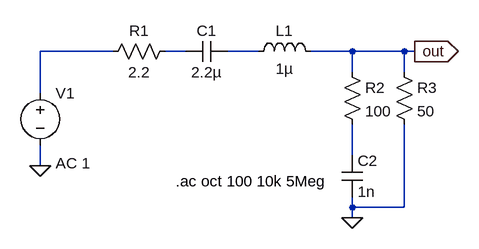
[diagram p0: schematic TI_TX.asc]
TI_TX.asc, the LTspice schematic file:
Version 4
SHEET 1 880 680
WIRE -160 96 -272 96
WIRE -48 96 -80 96
WIRE 64 96 16 96
WIRE 208 96 144 96
WIRE 288 96 208 96
WIRE 304 96 288 96
WIRE 208 128 208 96
WIRE 288 128 288 96
WIRE -272 160 -272 96
WIRE 208 256 208 208
WIRE -272 272 -272 240
WIRE 208 336 208 320
WIRE 288 336 288 208
WIRE 288 336 208 336
WIRE 208 352 208 336
FLAG -272 272 0
FLAG 304 96 out
IOPIN 304 96 Out
FLAG 208 352 0
SYMBOL res -64 80 R90
WINDOW 0 0 56 VBottom 2
WINDOW 3 32 56 VTop 2
SYMATTR InstName R1
SYMATTR Value 2.2
SYMBOL cap 16 80 R90
WINDOW 0 0 32 VBottom 2
WINDOW 3 32 32 VTop 2
SYMATTR InstName C1
SYMATTR Value 2.2µ
SYMBOL ind 48 112 R270
WINDOW 0 32 56 VTop 2
WINDOW 3 5 56 VBottom 2
SYMATTR InstName L1
SYMATTR Value 1µ
SYMBOL voltage -272 144 R0
WINDOW 3 24 152 Left 2
WINDOW 123 24 124 Left 2
WINDOW 39 0 0 Left 2
SYMATTR Value ""
SYMATTR Value2 AC 1
SYMATTR InstName V1
SYMBOL res 192 112 R0
SYMATTR InstName R2
SYMATTR Value 100
SYMBOL cap 192 256 R0
SYMATTR InstName C2
SYMATTR Value 1n
SYMBOL res 272 112 R0
SYMATTR InstName R3
SYMATTR Value 50
TEXT -64 296 Left 2 !.ac oct 100 10k 5Meg

The netlist it stands for:
* TI_TX.asc
R1 N002 N001 2.2
C1 N003 N002 2.2µ
L1 N003 out 1µ
V1 N001 0 AC 1
R2 out N004 100
C2 N004 0 1n
R3 out 0 50
.ac oct 100 10k 5Meg
.backanno
.end